# EAGLE design R001B (EAGLE 6.6.0)
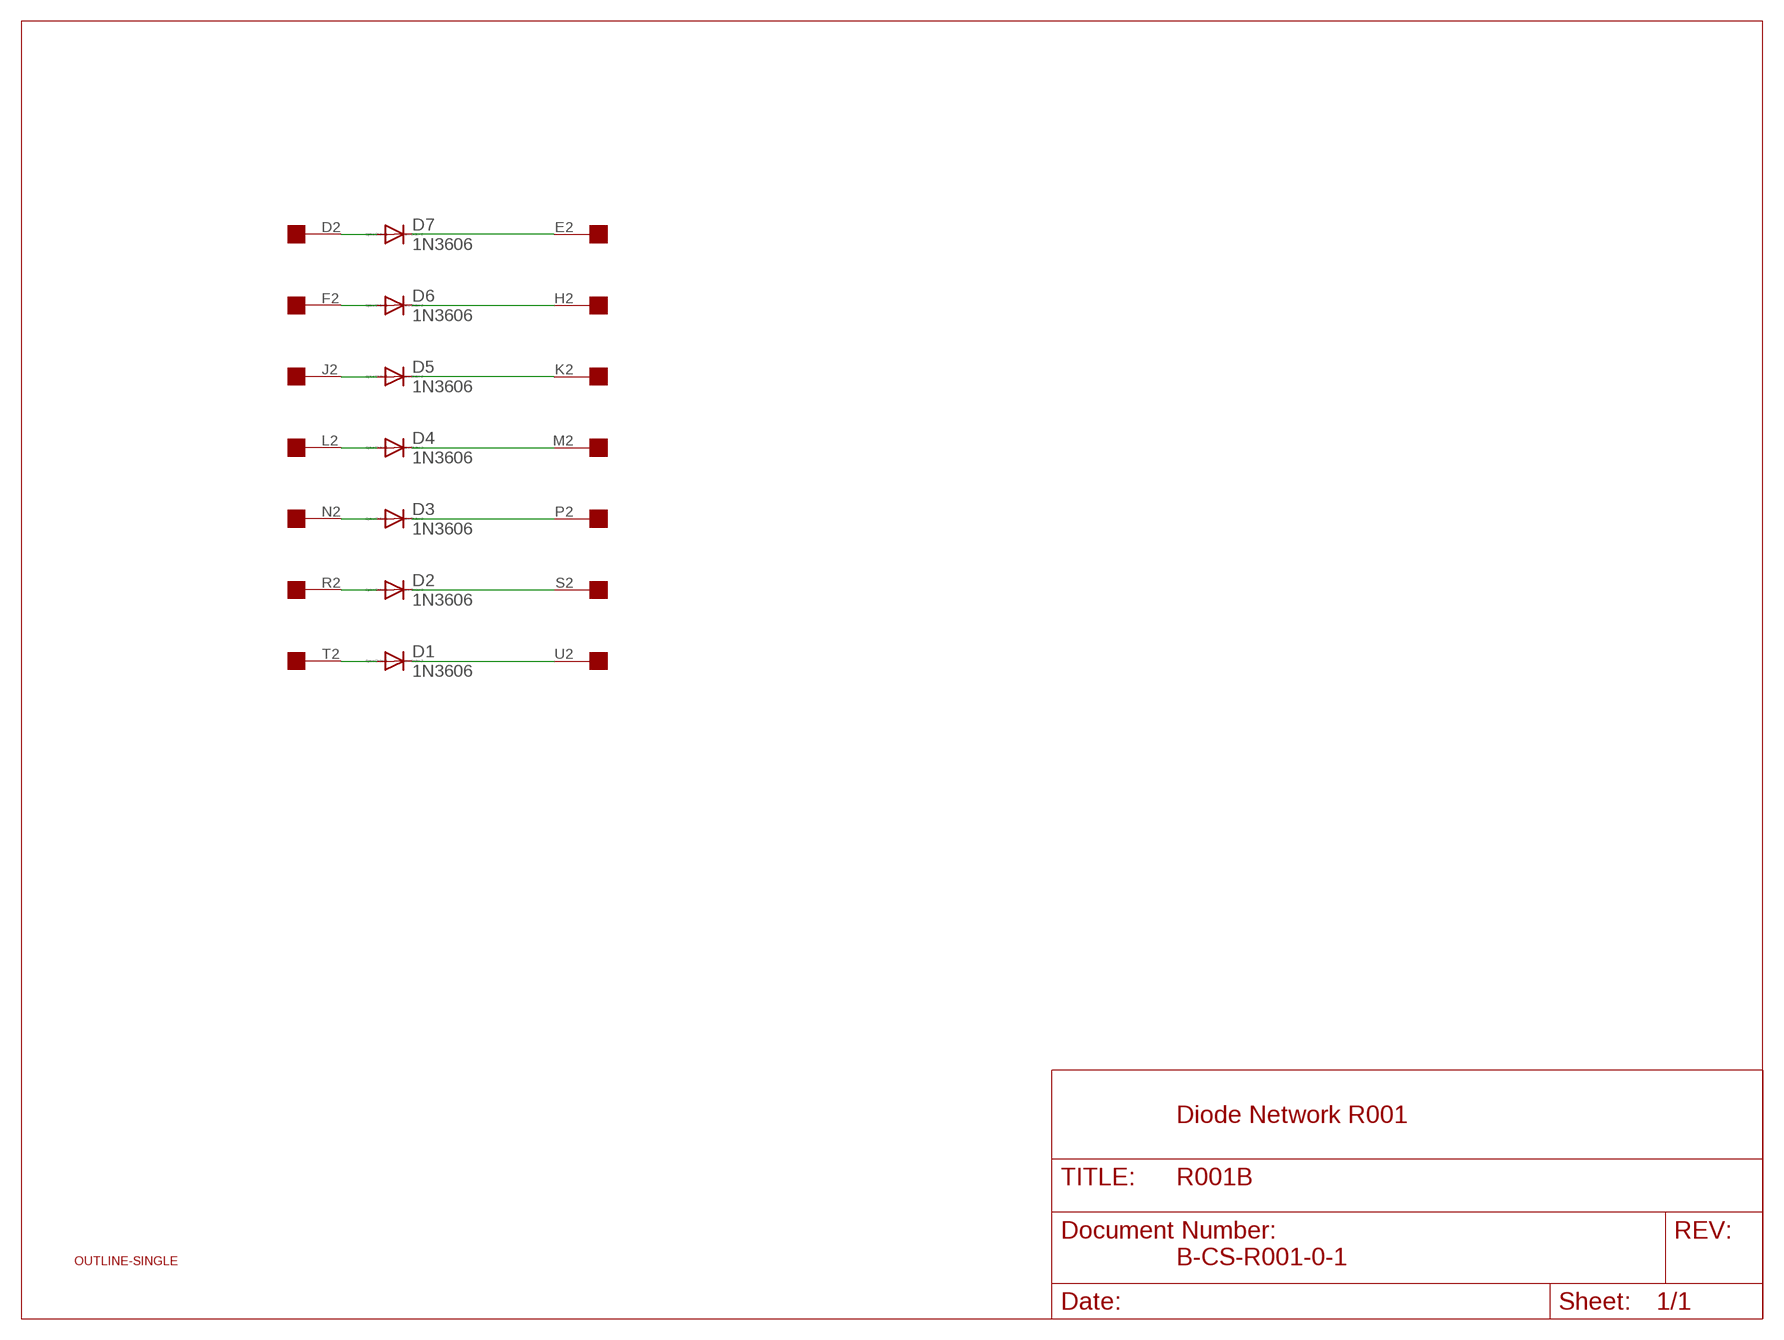
[diagram p0: schematic, sheet 1]

## Parts
D1  1N3606  1N4148DO35-10  [DO35-10]
D2  1N3606  1N4148DO35-10  [DO35-10]
D3  1N3606  1N4148DO35-10  [DO35-10]
D4  1N3606  1N4148DO35-10  [DO35-10]
D5  1N3606  1N4148DO35-10  [DO35-10]
D6  1N3606  1N4148DO35-10  [DO35-10]
D7  1N3606  1N4148DO35-10  [DO35-10]
U$1  OUTLINE-SINGLE  [SINGLE]
U$2  EDGE-1  [EDGE-CON1]

## Nets
N$1: D7.A U$2.D2
N$2: D6.A U$2.F2
N$3: D7.C U$2.E2
N$4: D6.C U$2.H2
N$5: D4.C U$2.M2
N$6: D5.C U$2.K2
N$7: D4.A U$2.L2
N$8: D3.A U$2.N2
N$9: D3.C U$2.P2
N$10: D5.A U$2.J2
N$11: D2.A U$2.R2
N$12: D2.C U$2.S2
N$13: D1.A U$2.T2
N$14: D1.C U$2.U2
Unconnected: U$2.A2 U$2.B2 U$2.C2 U$2.V2

## Notes on the sheet
- Diode Network R001
- B-CS-R001-0-1

## Library data of the parts
D1-D7 = diode:1N4148: DIODE high speed (Philips)
U$1 = dec-con:OUTLINE-*: Board outlines for DEC boards.
U$2 = dec-con:EDGE-1: Single-Sided DEC Edge Connector -- (side 2)

## Board
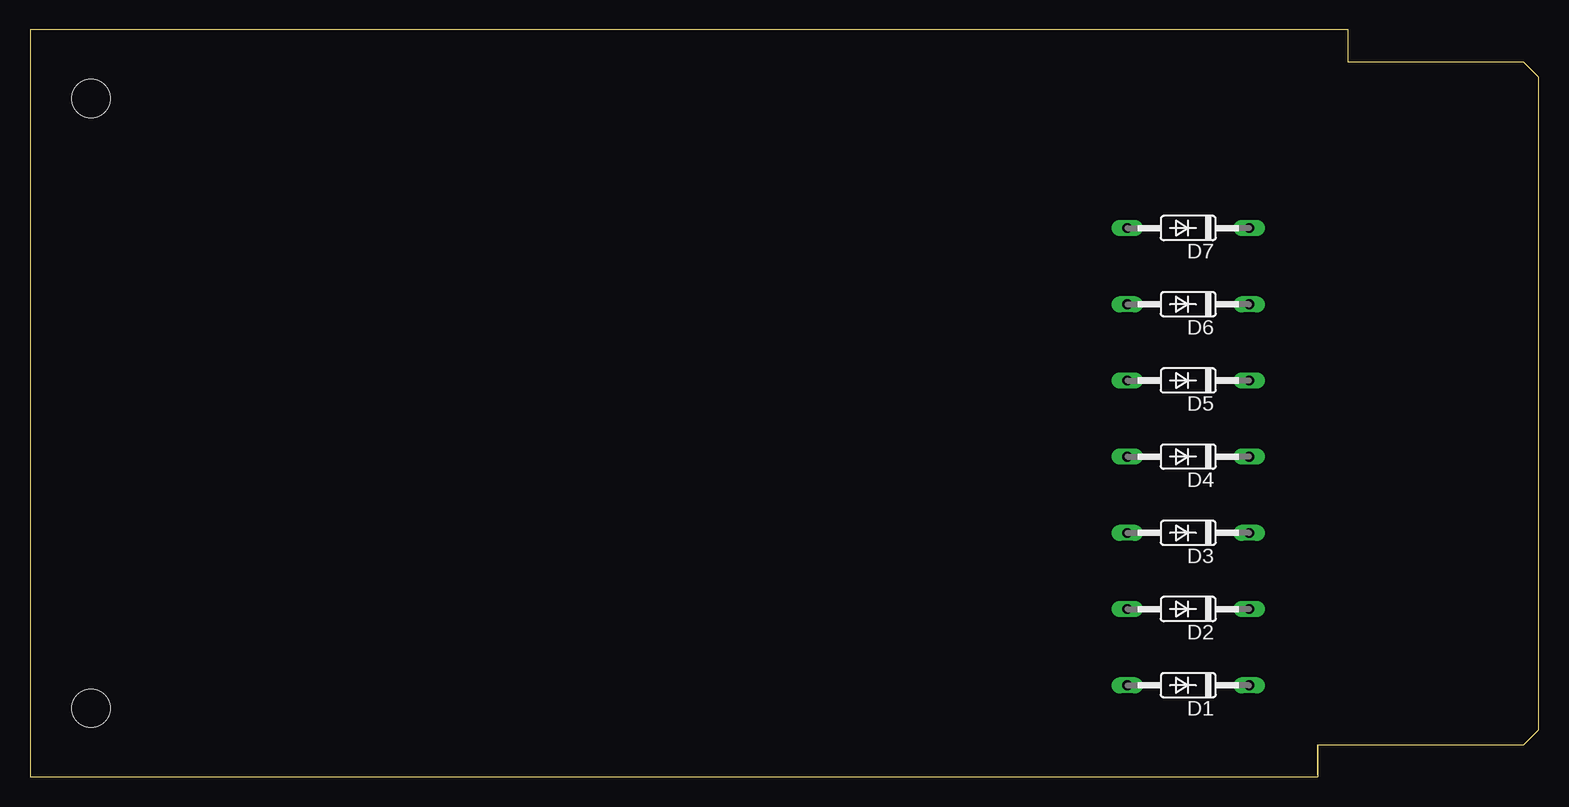
[diagram p1: board, top side]
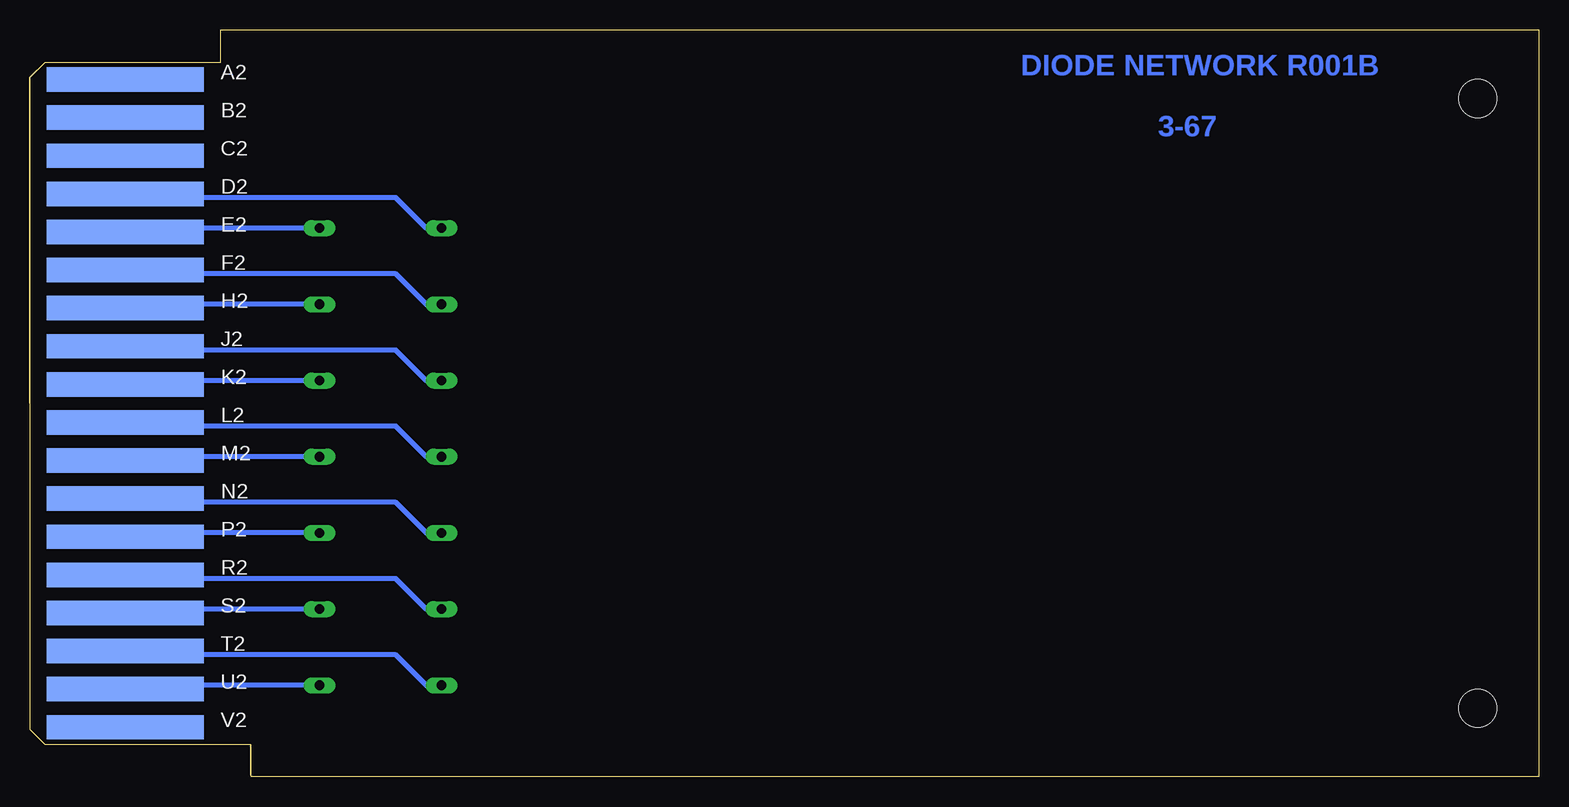
[diagram p2: board, bottom side, seen from below]

Size 125.73 x 62.23 mm. Coordinates in mm from the lower left corner, seen from the top.
Copper layers (1+16): Top 0.035mm / dielectric 1.5mm / Bottom 0.035mm
Design rules "16mils": minimum track width 16mil, minimum drill 32mil, track to track 15mil, track to pad 10mil, pad to pad 10mil, via to via 10mil, smd to smd 10mil, copper to edge 13mil, drill to drill 10mil, minimum pad ring 10mil, minimum via ring 8mil, stop-mask expansion 0mil, vias tented up to drill 0mil, thermal gap 10mil

### Footprints (pad centres in the part's own frame; a part is rotated, then mirrored left to right if it is on the bottom)
DO35-10 = drill 0.813 long: A 5.08,0; C -5.08,0
SINGLE = hole 3.175: 120.65,56.515; 120.65,5.715
EDGE-CON1 = smd 13.106 x 2.032 bottom: A2 7.938,4.128; B2 7.938,7.303; C2 7.938,10.477; D2 7.938,13.652; E2 7.938,16.828; F2 7.938,20.003; H2 7.938,23.177; J2 7.938,26.352; K2 7.938,29.527; L2 7.938,32.703; M2 7.938,35.877; N2 7.938,39.053; P2 7.938,42.227; R2 7.938,45.403; S2 7.938,48.578; T2 7.938,51.752; U2 7.938,54.928; V2 7.938,58.102

### Placement (x,y rotation side)
D1  96.52,7.62 180 top
D2  96.52,13.97 180 top
D3  96.52,20.32 180 top
D4  96.52,26.67 180 top
D5  96.52,33.02 180 top
D6  96.52,39.37 180 top
D7  96.52,45.72 180 top
U$1  125.73,62.23 180 top
U$2  125.73,62.23 180 top

### Tracks (layer width: path | path; a pad name or v marks a point on that pad's centre or on a via)
N$1
  Bottom 0.406: D7.A 92.71,45.72 95.25,48.26 112.39,48.26 U$2.D2
N$2
  Bottom 0.406: D6.A 92.71,39.37 95.25,41.91 112.39,41.91 U$2.F2
N$3
  Bottom 0.406: D7.C 111.76,45.72 U$2.E2
N$4
  Bottom 0.406: D6.C 111.76,39.37 U$2.H2
N$5
  Bottom 0.406: D4.C 111.76,26.67 U$2.M2
N$6
  Bottom 0.406: D5.C 111.76,33.02 U$2.K2
N$7
  Bottom 0.406: D4.A 92.71,26.67 95.25,29.21 112.39,29.21 U$2.L2
N$8
  Bottom 0.406: D3.A 92.71,20.32 95.25,22.86 112.39,22.86 U$2.N2
N$9
  Bottom 0.406: D3.C 111.76,20.32 U$2.P2
N$10
  Bottom 0.406: D5.A 92.71,33.02 95.25,35.56 112.39,35.56 U$2.J2
N$11
  Bottom 0.406: D2.A 92.71,13.97 95.25,16.51 112.39,16.51 U$2.R2
N$12
  Bottom 0.406: D2.C 111.76,13.97 U$2.S2
N$13
  Bottom 0.406: D1.A 92.71,7.62 95.25,10.16 112.39,10.16 U$2.T2
N$14
  Bottom 0.406: D1.C 111.76,7.62 U$2.U2

### Text on the board
Bottom: DIODE NETWORK R001B | 3-67